# EAGLE schematic MovingTargetUnit (EAGLE 9.6.2)
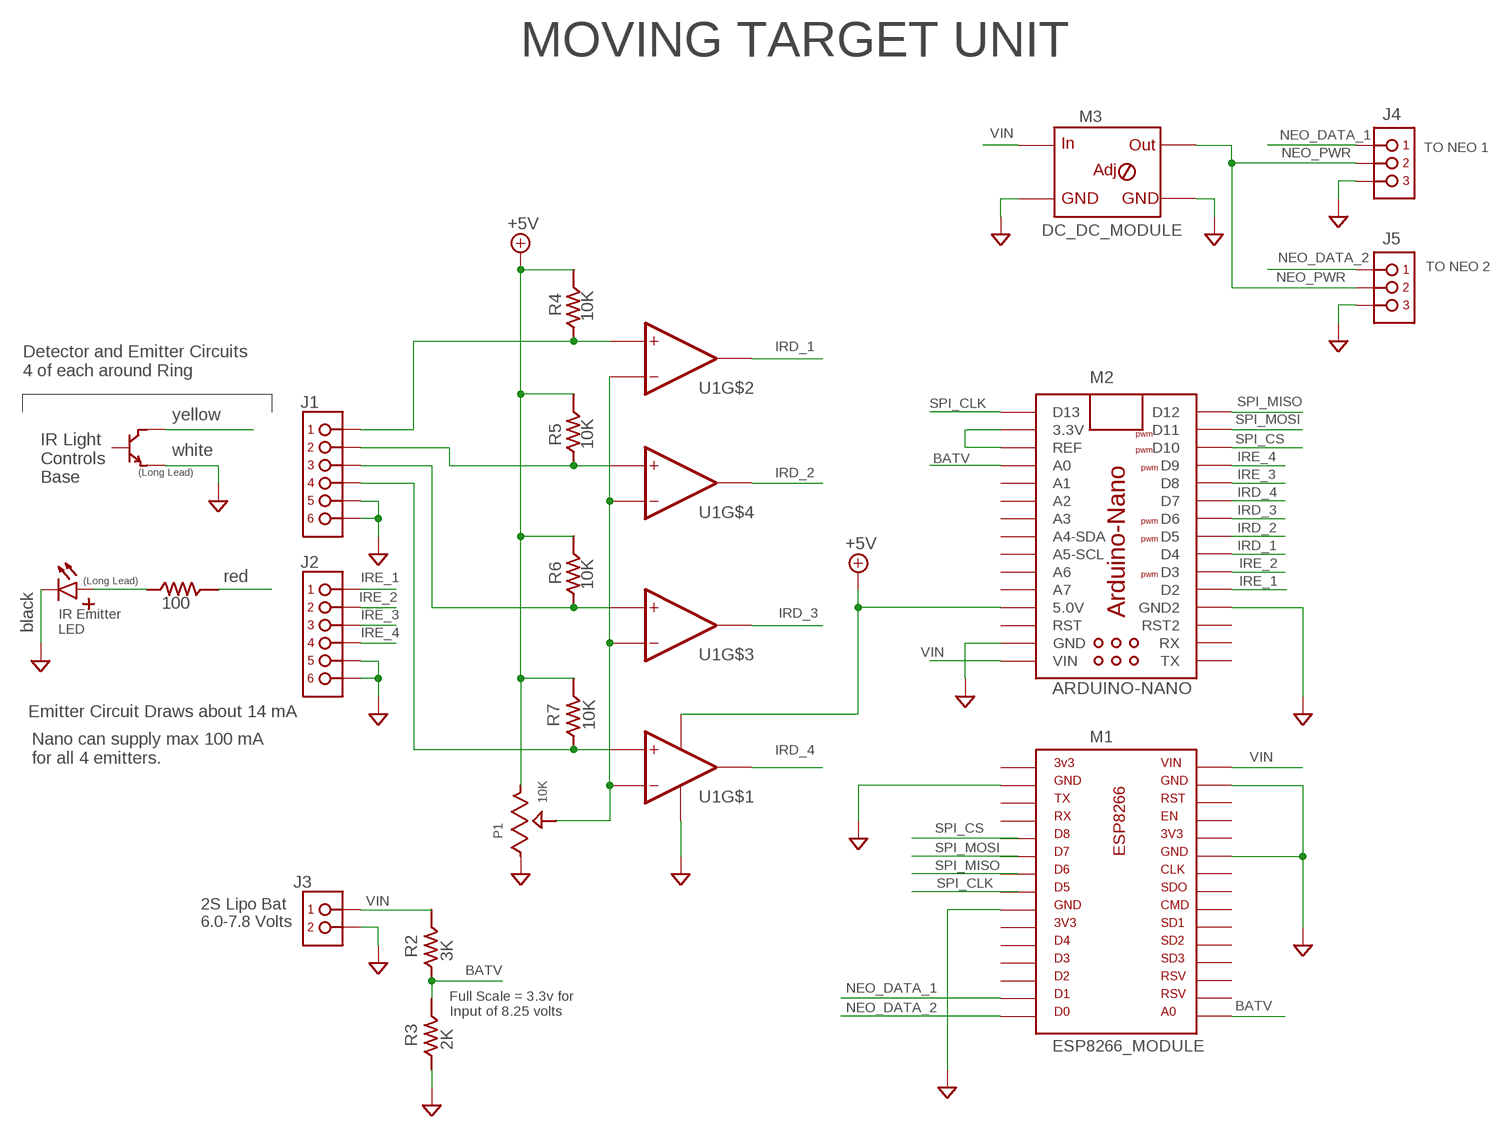
[diagram p0: schematic, sheet 1]

## Parts
J1  PINHDR_1X6-XH  [JST-XH_098_VERT_1X6]
J2  PINHDR_1X6-XH  [JST-XH_098_VERT_1X6]
J3  PINHDR_1X2-100  [PINHDR_TH_100_1X2]
J4  PINHDR_1X3-100  [PINHDR_TH_100_1X3]
J5  PINHDR_1X3-100  [PINHDR_TH_100_1X3]
LED1  IR Emitter LED  LED1206  [LED_1206]
M1  ESP8266_MODULE  [ESP8266_MODULE]
M2  ARDUINO-NANO  [ARDUINO-NANO]
M3  DC_DC_MODULE  [DC_DC_MODULE]
P1  10K  TRIMPOTSIP  [TRIMPOT_SIP_100]
R1  100  R1206(3216METRIC)  [R1206]
R2  3K  R1206(3216METRIC)  [R1206]
R3  2K  R1206(3216METRIC)  [R1206]
R4  10K  R1206(3216METRIC)  [R1206]
R5  10K  R1206(3216METRIC)  [R1206]
R6  10K  R1206(3216METRIC)  [R1206]
R7  10K  R1206(3216METRIC)  [R1206]
T1  T_NPN  [TO-92]
U1  LM2902  [SO16LNB-14PIN]

## Nets
+5V: M2.5V(5.0V) P1.P$3 R4.P$2 R5.P$2 R6.P$2 R7.P$2 U1.P$4(P+)
BATV: M1.P$16 M2.A0 R2.P$1 R3.P$2
GND: J1.1 J1.2 J2.1 J2.2 J3.2 J4.3 J5.3 LED1.CATHODE(-)(CATHODE) M1.P$2 M1.P$9 M1.P$25 M1.P$29 M2.GND M2.GND2 M3.IN-(G1) M3.OUT-(G2) P1.P$1 R3.P$1 T1.P$3(EMITTER) U1.P$11(P-)
IRD_1: M2.D4 U1.P$7(OUT)
IRD_2: M2.D5 U1.P$14(OUT)
IRD_3: M2.D6 U1.P$8(OUT)
IRD_4: M2.D7 U1.P$1(OUT)
IRE_1: J2.6 M2.D2
IRE_2: J2.5 M2.D3
IRE_3: J2.4 M2.D8
IRE_4: J2.3 M2.D9
N$3: M2.3.3(3.3V) M2.REF
N$5: J1.6 R4.P$1 U1.P$5(+IN)
N$6: J1.5 R5.P$1 U1.P$12(+IN)
N$7: J1.4 R6.P$1 U1.P$10(+IN)
N$8: J1.3 R7.P$1 U1.P$3(+IN)
N$9: R1.P$2
N$10: LED1.ANODE(+)(ANODE) R1.P$1
N$11: P1.P$2 U1.P$2(-IN) U1.P$6(-IN) U1.P$9(-IN) U1.P$13(-IN)
N$13: T1.P$1(COLLECTOR)
NEO_DATA_1: J4.1 M1.P$14
NEO_DATA_2: J5.1 M1.P$15
NEO_PWR: J4.2 J5.2 M3.OUT+(OUT)
SPI_CLK: M1.P$8 M2.D13
SPI_CS: M1.P$5 M2.D10
SPI_MISO: M1.P$7 M2.D12
SPI_MOSI: M1.P$6 M2.D11
VIN: J3.1 M1.P$30 M2.VIN M3.IN+(IN) R2.P$2
Unconnected: M1.P$1 M1.P$3 M1.P$4 M1.P$10 M1.P$11 M1.P$12 M1.P$13 M1.P$17 M1.P$18 M1.P$19 M1.P$20 M1.P$21 M1.P$22 M1.P$23 M1.P$24 M1.P$26 M1.P$27 M1.P$28 M2.A1 M2.A2 M2.A3 M2.A4(A4-SDA) M2.A5(A5-SCL) M2.A6 M2.A7 M2.RST M2.RST2 M2.RX M2.TX T1.P$2(BASE)

## Notes on the sheet
- MOVING TARGET UNIT
- TO NEO 1
- TO NEO 2
- Detector and Emitter Circuits
  4 of each around Ring
- yellow
- white
- (Long Lead)
- IR Light 
  Controls 
  Base
- (Long Lead) | red
- black
- IR Emitter
  LED
- Emitter Circuit Draws about 14 mA
- Nano can supply max 100 mA
  for all 4 emitters.
- 2S Lipo Bat
  6.0-7.8 Volts
- Full Scale = 3.3v for 
  Input of 8.25 volts

## Library data of the parts
J1 J2 = Dal_V2:PINHDR_1X6
J3 = Dal_V2:PINHDR_1X2
J4 J5 = Dal_V2:PINHDR_1X3
LED1 = Dal_V2:LED: Standard LED
M1 = Dal_V2:ESP8266_MODULE
M2 = Dal_V2:ARDUINO-NANO
M3 = Dal_V2:DC_DC_MODULE
P1 = Dal_V2:TRIMPOT
R1-R7 = Dal_V2:R: Standard Resistor -- Various Sizes and Wattages
T1 = Dal_V2:T_NPN
U1 = Dal_V2:LM2902